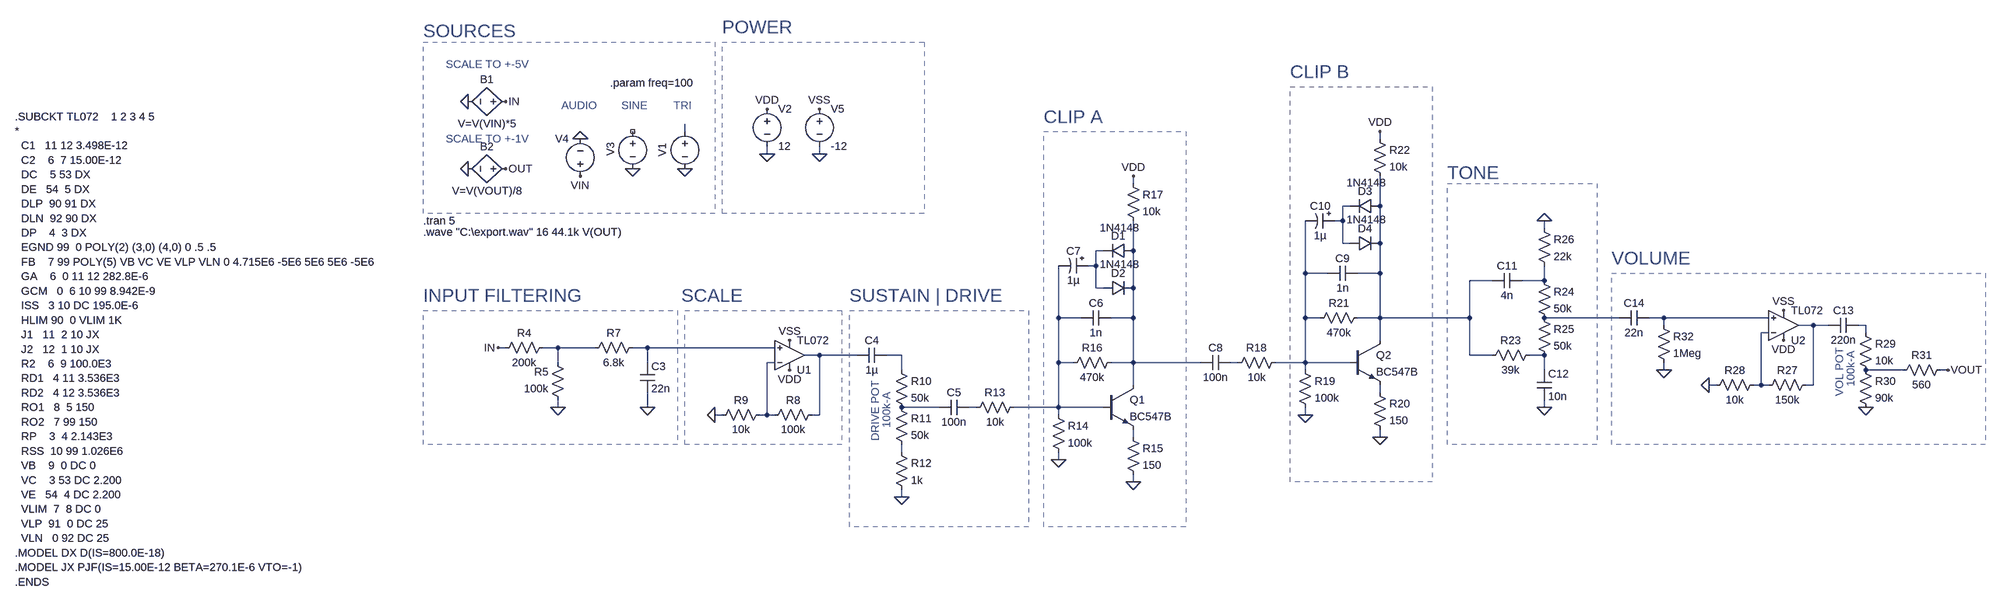
[diagram p0: schematic fuzz.asc]
fuzz.asc, the LTspice schematic file:
Version 4
SHEET 1 3172 1036
WIRE 128 128 128 112
WIRE 1616 144 1616 128
WIRE 304 176 304 160
WIRE 416 176 416 160
WIRE 1088 240 1088 224
WIRE 1552 288 1536 288
WIRE 1616 288 1616 224
WIRE 1536 320 1536 288
WIRE 1536 320 1520 320
WIRE 1968 336 1968 320
WIRE 1536 368 1536 320
WIRE 1552 368 1536 368
WIRE 1616 368 1616 288
WIRE 1024 384 1008 384
WIRE 1088 384 1088 320
WIRE 1008 416 1008 384
WIRE 1008 416 992 416
WIRE 1456 432 1456 320
WIRE 1504 432 1456 432
WIRE 1616 432 1616 368
WIRE 1616 432 1568 432
WIRE 1856 448 1808 448
WIRE 1968 448 1968 416
WIRE 1968 448 1920 448
WIRE 1008 464 1008 416
WIRE 1024 464 1008 464
WIRE 1088 464 1088 384
WIRE 928 528 928 416
WIRE 976 528 928 528
WIRE 1088 528 1088 464
WIRE 1088 528 1040 528
WIRE 1456 528 1456 432
WIRE 1488 528 1456 528
WIRE 1616 528 1616 432
WIRE 1616 528 1568 528
WIRE 1808 528 1808 448
WIRE 1808 528 1616 528
WIRE 2128 528 1968 528
WIRE 2224 528 2192 528
WIRE 2448 528 2224 528
WIRE 2224 544 2224 528
WIRE 2544 544 2512 544
WIRE 2576 544 2544 544
WIRE 2656 544 2640 544
WIRE 2448 560 2432 560
WIRE 2656 560 2656 544
WIRE 1616 576 1616 528
WIRE -256 592 -272 592
WIRE -144 592 -176 592
WIRE -64 592 -144 592
WIRE 48 592 16 592
WIRE 320 592 48 592
WIRE 416 608 384 608
WIRE 496 608 416 608
WIRE 592 608 560 608
WIRE 1808 608 1808 528
WIRE 1856 608 1808 608
WIRE 1968 608 1936 608
WIRE -144 624 -144 592
WIRE 48 624 48 592
WIRE 320 624 304 624
WIRE 928 624 928 528
WIRE 960 624 928 624
WIRE 1088 624 1088 528
WIRE 1088 624 1040 624
WIRE 1232 624 1088 624
WIRE 1312 624 1296 624
WIRE 1456 624 1456 528
WIRE 1456 624 1392 624
WIRE 1552 624 1456 624
WIRE 592 640 592 608
WIRE 1456 640 1456 624
WIRE 1968 640 1968 608
WIRE 2224 640 2224 624
WIRE 2736 640 2656 640
WIRE 2832 640 2816 640
WIRE 1088 672 1088 624
WIRE 2336 672 2320 672
WIRE 2432 672 2432 560
WIRE 2432 672 2416 672
WIRE 2448 672 2432 672
WIRE 2544 672 2544 544
WIRE 2544 672 2528 672
WIRE 1616 688 1616 672
WIRE -144 720 -144 704
WIRE 48 720 48 688
WIRE 672 720 592 720
WIRE 752 720 736 720
WIRE 928 720 928 624
WIRE 928 720 832 720
WIRE 1024 720 928 720
WIRE 1968 720 1968 704
WIRE 208 736 192 736
WIRE 304 736 304 624
WIRE 304 736 288 736
WIRE 320 736 304 736
WIRE 416 736 416 608
WIRE 416 736 400 736
WIRE 928 736 928 720
WIRE 1456 736 1456 720
WIRE 1088 784 1088 768
WIRE 1616 784 1616 768
WIRE 592 816 592 800
WIRE 928 832 928 816
WIRE 1088 880 1088 864
WIRE 592 912 592 896
FLAG -96 224 VIN
FLAG -256 64 IN
FLAG -256 208 OUT
FLAG -272 592 IN
FLAG 352 576 VSS
FLAG 352 640 VDD
FLAG 1088 224 VDD
FLAG 1616 128 VDD
FLAG 2480 512 VSS
FLAG 2480 576 VDD
FLAG 2832 640 VOUT
FLAG 416 176 0
FLAG 304 176 0
FLAG 304 80 VDD
FLAG 416 80 VSS
FLAG 128 208 0
FLAG 16 208 0
FLAG -96 144 0
FLAG -336 208 0
FLAG -336 64 0
FLAG -144 720 0
FLAG 48 720 0
FLAG 192 736 0
FLAG 592 912 0
FLAG 1088 880 0
FLAG 928 832 0
FLAG 1456 736 0
FLAG 1616 784 0
FLAG 1968 720 0
FLAG 1968 320 0
FLAG 2224 640 0
FLAG 2320 672 0
FLAG 2656 720 0
SYMBOL voltage 128 112 R0
WINDOW 0 -32 56 VBottom 2
WINDOW 3 32 56 Invisible 2
WINDOW 123 0 0 Left 0
WINDOW 39 0 0 Left 0
SYMATTR InstName V1
SYMATTR Value PULSE(0 250m 0 {0.5/freq} {0.5/freq} 0 {1/freq})
SYMBOL voltage 16 112 R0
WINDOW 0 -47 39 VRight 2
WINDOW 3 24 96 Invisible 2
WINDOW 123 0 0 Left 0
WINDOW 39 0 0 Left 0
SYMATTR InstName V3
SYMATTR Value SINE(0 1 {freq})
SYMBOL voltage -96 240 R180
WINDOW 0 24 96 Left 2
WINDOW 3 24 16 Invisible 2
SYMATTR InstName V4
SYMATTR Value wavefile="C:\input.wav" chan=0
SYMBOL bv -240 64 R90
WINDOW 0 -32 56 VBottom 2
WINDOW 3 32 56 VTop 2
SYMATTR InstName B1
SYMATTR Value V=V(VIN)*5
SYMBOL bv -240 208 R90
WINDOW 0 -32 56 VBottom 2
WINDOW 3 32 56 VTop 2
SYMATTR InstName B2
SYMATTR Value V=V(VOUT)/8
SYMBOL res -160 576 R90
WINDOW 0 0 56 VBottom 2
WINDOW 3 32 56 VTop 2
SYMATTR InstName R4
SYMATTR Value 200k
SYMBOL res -128 720 R180
WINDOW 0 36 76 Left 2
WINDOW 3 36 40 Left 2
SYMATTR InstName R5
SYMATTR Value 100k
SYMBOL res 32 576 R90
WINDOW 0 0 56 VBottom 2
WINDOW 3 32 56 VTop 2
SYMATTR InstName R7
SYMATTR Value 6.8k
SYMBOL cap 32 624 R0
SYMATTR InstName C3
SYMATTR Value 22n
SYMBOL OpAmps\\opamp2 352 672 M180
SYMATTR InstName U1
SYMATTR Value TL072
SYMBOL res 416 720 R90
WINDOW 0 0 56 VBottom 2
WINDOW 3 32 56 VTop 2
SYMATTR InstName R8
SYMATTR Value 100k
SYMBOL res 304 720 R90
WINDOW 0 0 56 VBottom 2
WINDOW 3 32 56 VTop 2
SYMATTR InstName R9
SYMATTR Value 10k
SYMBOL cap 560 592 R90
WINDOW 0 0 32 VBottom 2
WINDOW 3 32 32 VTop 2
SYMATTR InstName C4
SYMATTR Value 1µ
SYMBOL res 576 624 R0
SYMATTR InstName R10
SYMATTR Value 50k
SYMBOL res 576 704 R0
SYMATTR InstName R11
SYMATTR Value 50k
SYMBOL res 576 800 R0
SYMATTR InstName R12
SYMATTR Value 1k
SYMBOL cap 736 704 R90
WINDOW 0 0 32 VBottom 2
WINDOW 3 32 32 VTop 2
SYMATTR InstName C5
SYMATTR Value 100n
SYMBOL res 848 704 R90
WINDOW 0 0 56 VBottom 2
WINDOW 3 32 56 VTop 2
SYMATTR InstName R13
SYMATTR Value 10k
SYMBOL res 912 720 R0
SYMATTR InstName R14
SYMATTR Value 100k
SYMBOL npn 1024 672 R0
SYMATTR InstName Q1
SYMATTR Value BC547B
SYMBOL res 1072 768 R0
SYMATTR InstName R15
SYMATTR Value 150
SYMBOL res 1056 608 R90
WINDOW 0 0 56 VBottom 2
WINDOW 3 32 56 VTop 2
SYMATTR InstName R16
SYMATTR Value 470k
SYMBOL cap 1040 512 R90
WINDOW 0 0 32 VBottom 2
WINDOW 3 32 32 VTop 2
SYMATTR InstName C6
SYMATTR Value 1n
SYMBOL polcap 992 400 R90
WINDOW 0 0 32 VBottom 2
WINDOW 3 32 32 VTop 2
SYMATTR InstName C7
SYMATTR Value 1µ
SYMBOL diode 1088 368 R90
WINDOW 0 0 32 VBottom 2
WINDOW 3 -18 29 VBottom 2
SYMATTR InstName D1
SYMATTR Value 1N4148
SYMBOL diode 1024 480 R270
WINDOW 0 32 32 VTop 2
WINDOW 3 51 35 VTop 2
SYMATTR InstName D2
SYMATTR Value 1N4148
SYMBOL res 1072 224 R0
SYMATTR InstName R17
SYMATTR Value 10k
SYMBOL cap 1296 608 R90
WINDOW 0 0 32 VBottom 2
WINDOW 3 32 32 VTop 2
SYMATTR InstName C8
SYMATTR Value 100n
SYMBOL res 1408 608 R90
WINDOW 0 0 56 VBottom 2
WINDOW 3 32 56 VTop 2
SYMATTR InstName R18
SYMATTR Value 10k
SYMBOL res 1440 624 R0
SYMATTR InstName R19
SYMATTR Value 100k
SYMBOL npn 1552 576 R0
SYMATTR InstName Q2
SYMATTR Value BC547B
SYMBOL res 1600 672 R0
SYMATTR InstName R20
SYMATTR Value 150
SYMBOL res 1584 512 R90
WINDOW 0 0 56 VBottom 2
WINDOW 3 32 56 VTop 2
SYMATTR InstName R21
SYMATTR Value 470k
SYMBOL cap 1568 416 R90
WINDOW 0 0 32 VBottom 2
WINDOW 3 32 32 VTop 2
SYMATTR InstName C9
SYMATTR Value 1n
SYMBOL polcap 1520 304 R90
WINDOW 0 0 32 VBottom 2
WINDOW 3 32 32 VTop 2
SYMATTR InstName C10
SYMATTR Value 1µ
SYMBOL diode 1616 272 R90
WINDOW 0 0 32 VBottom 2
WINDOW 3 -18 29 VBottom 2
SYMATTR InstName D3
SYMATTR Value 1N4148
SYMBOL diode 1552 384 R270
WINDOW 0 32 32 VTop 2
WINDOW 3 51 35 VTop 2
SYMATTR InstName D4
SYMATTR Value 1N4148
SYMBOL res 1600 128 R0
SYMATTR InstName R22
SYMATTR Value 10k
SYMBOL res 1952 592 R90
WINDOW 0 0 56 VBottom 2
WINDOW 3 32 56 VTop 2
SYMATTR InstName R23
SYMATTR Value 39k
SYMBOL cap 1920 432 R90
WINDOW 0 0 32 VBottom 2
WINDOW 3 32 32 VTop 2
SYMATTR InstName C11
SYMATTR Value 4n
SYMBOL res 1952 432 R0
SYMATTR InstName R24
SYMATTR Value 50k
SYMBOL res 1952 512 R0
SYMATTR InstName R25
SYMATTR Value 50k
SYMBOL res 1952 320 R0
SYMATTR InstName R26
SYMATTR Value 22k
SYMBOL cap 1952 640 R0
SYMATTR InstName C12
SYMATTR Value 10n
SYMBOL OpAmps\\opamp2 2480 608 M180
SYMATTR InstName U2
SYMATTR Value TL072
SYMBOL res 2544 656 R90
WINDOW 0 0 56 VBottom 2
WINDOW 3 32 56 VTop 2
SYMATTR InstName R27
SYMATTR Value 150k
SYMBOL res 2432 656 R90
WINDOW 0 0 56 VBottom 2
WINDOW 3 32 56 VTop 2
SYMATTR InstName R28
SYMATTR Value 10k
SYMBOL res 2640 544 R0
SYMATTR InstName R29
SYMATTR Value 10k
SYMBOL res 2640 624 R0
SYMATTR InstName R30
SYMATTR Value 90k
SYMBOL res 2832 624 R90
WINDOW 0 0 56 VBottom 2
WINDOW 3 32 56 VTop 2
SYMATTR InstName R31
SYMATTR Value 560
SYMBOL cap 2640 528 R90
WINDOW 0 0 32 VBottom 2
WINDOW 3 32 32 VTop 2
SYMATTR InstName C13
SYMATTR Value 220n
SYMBOL res 2208 528 R0
SYMATTR InstName R32
SYMATTR Value 1Meg
SYMBOL cap 2192 512 R90
WINDOW 0 0 32 VBottom 2
WINDOW 3 32 32 VTop 2
SYMATTR InstName C14
SYMATTR Value 22n
SYMBOL voltage 304 64 R0
WINDOW 123 0 0 Left 0
WINDOW 39 0 0 Left 0
SYMATTR InstName V2
SYMATTR Value 12
SYMBOL voltage 416 64 R0
WINDOW 123 0 0 Left 0
WINDOW 39 0 0 Left 0
SYMATTR InstName V5
SYMATTR Value -12
TEXT -32 24 Left 2 !.param freq=100
TEXT -8 72 Left 2 ;SINE
TEXT 104 72 Left 2 ;TRI
TEXT -136 72 Left 2 ;AUDIO
TEXT -432 -88 Left 4 ;SOURCES
TEXT 208 -96 Left 4 ;POWER
TEXT -384 -16 Left 2 ;SCALE TO +-5V
TEXT -384 144 Left 2 ;SCALE TO +-1V
TEXT -432 320 Left 2 !.tran 5
TEXT -432 344 Left 2 !.wave "C:\\export.wav" 16 44.1k V(OUT)
TEXT -432 480 Left 4 ;INPUT FILTERING
TEXT 120 480 Left 4 ;SCALE
TEXT 536 664 VRight 2 ;DRIVE POT
TEXT 560 688 VRight 2 ;100k-A
TEXT 480 480 Left 4 ;SUSTAIN | DRIVE
TEXT 896 96 Left 4 ;CLIP A
TEXT -1488 96 Left 2 !.SUBCKT TL072    1 2 3 4 5\n*\n  C1   11 12 3.498E-12\n  C2    6  7 15.00E-12\n  DC    5 53 DX\n  DE   54  5 DX\n  DLP  90 91 DX\n  DLN  92 90 DX\n  DP    4  3 DX\n  EGND 99  0 POLY(2) (3,0) (4,0) 0 .5 .5\n  FB    7 99 POLY(5) VB VC VE VLP VLN 0 4.715E6 -5E6 5E6 5E6 -5E6\n  GA    6  0 11 12 282.8E-6\n  GCM   0  6 10 99 8.942E-9\n  ISS   3 10 DC 195.0E-6\n  HLIM 90  0 VLIM 1K\n  J1   11  2 10 JX\n  J2   12  1 10 JX\n  R2    6  9 100.0E3\n  RD1   4 11 3.536E3\n  RD2   4 12 3.536E3\n  RO1   8  5 150\n  RO2   7 99 150\n  RP    3  4 2.143E3\n  RSS  10 99 1.026E6\n  VB    9  0 DC 0\n  VC    3 53 DC 2.200\n  VE   54  4 DC 2.200\n  VLIM  7  8 DC 0\n  VLP  91  0 DC 25\n  VLN   0 92 DC 25\n.MODEL DX D(IS=800.0E-18)\n.MODEL JX PJF(IS=15.00E-12 BETA=270.1E-6 VTO=-1)\n.ENDS
TEXT 1424 0 Left 4 ;CLIP B
TEXT 1760 216 Left 4 ;TONE
TEXT 2600 592 VRight 2 ;VOL POT
TEXT 2624 600 VRight 2 ;100k-A
TEXT 2112 400 Left 4 ;VOLUME
RECTANGLE Normal 640 304 208 -64 1
RECTANGLE Normal 192 304 -432 -64 1
RECTANGLE Normal 112 800 -432 512 1
RECTANGLE Normal 464 800 128 512 1
RECTANGLE Normal 864 976 480 512 1
RECTANGLE Normal 1200 976 896 128 1
RECTANGLE Normal 1728 880 1424 32 1
RECTANGLE Normal 2080 800 1760 240 1
RECTANGLE Normal 2912 800 2112 432 1

The netlist it stands for:
* fuzz.asc
V1 N001 0 PULSE(0 250m 0 {0.5/freq} {0.5/freq} 0 {1/freq})
V3 NC_01 0 SINE(0 1 {freq})
V4 VIN 0 wavefile="C:\input.wav" chan=0
B1 IN 0 V=V(VIN)*5
B2 OUT 0 V=V(VOUT)/8
R4 N014 IN 200k
R5 0 N014 100k
R7 N015 N014 6.8k
C3 N015 0 22n
XU1 N015 N019 VDD VSS N016 TL072  ; pins In+ In- V+ V- OUT
R8 N016 N019 100k
R9 N019 0 10k
C4 N017 N016 1µ
R10 N017 N023 50k
R11 N023 N026 50k
R12 N026 0 1k
C5 N024 N023 100n
R13 N008 N024 10k
R14 N008 0 100k
Q1 N005 N008 N025 0 BC547B
R15 N025 0 150
R16 N005 N008 470k
C6 N005 N008 1n
C7 N004 N008 1µ
D1 N005 N004 1N4148
D2 N004 N005 1N4148
R17 VDD N005 10k
C8 N020 N005 100n
R18 N006 N020 10k
R19 N006 0 100k
Q2 N003 N006 N022 0 BC547B
R20 N022 0 150
R21 N003 N006 470k
C9 N003 N006 1n
C10 N002 N006 1µ
D3 N003 N002 1N4148
D4 N002 N003 1N4148
R22 VDD N003 10k
R23 N018 N003 39k
C11 N007 N003 4n
R24 N007 N009 50k
R25 N009 N018 50k
R26 0 N007 22k
C12 N018 0 10n
XU2 N010 N013 VDD VSS N011 TL072  ; pins In+ In- V+ V- OUT
R27 N011 N013 150k
R28 N013 0 10k
R29 N012 N021 10k
R30 N021 0 90k
R31 VOUT N021 560
C13 N012 N011 220n
R32 N010 0 1Meg
C14 N010 N009 22n
V2 VDD 0 12
V5 VSS 0 -12
.model D D
.lib standard.dio
.model NPN NPN
.model PNP PNP
.lib standard.bjt
.param freq=100
* SINE
* TRI
* AUDIO
* SOURCES
* POWER
* SCALE TO +-5V
* SCALE TO +-1V
.tran 5
.wave "C:\export.wav" 16 44.1k V(OUT)
* INPUT FILTERING
* SCALE
* DRIVE POT
* 100k-A
* SUSTAIN | DRIVE
* CLIP A
.SUBCKT TL072    1 2 3 4 5
*
  C1   11 12 3.498E-12
  C2    6  7 15.00E-12
  DC    5 53 DX
  DE   54  5 DX
  DLP  90 91 DX
  DLN  92 90 DX
  DP    4  3 DX
  EGND 99  0 POLY(2) (3,0) (4,0) 0 .5 .5
  FB    7 99 POLY(5) VB VC VE VLP VLN 0 4.715E6 -5E6 5E6 5E6 -5E6
  GA    6  0 11 12 282.8E-6
  GCM   0  6 10 99 8.942E-9
  ISS   3 10 DC 195.0E-6
  HLIM 90  0 VLIM 1K
  J1   11  2 10 JX
  J2   12  1 10 JX
  R2    6  9 100.0E3
  RD1   4 11 3.536E3
  RD2   4 12 3.536E3
  RO1   8  5 150
  RO2   7 99 150
  RP    3  4 2.143E3
  RSS  10 99 1.026E6
  VB    9  0 DC 0
  VC    3 53 DC 2.200
  VE   54  4 DC 2.200
  VLIM  7  8 DC 0
  VLP  91  0 DC 25
  VLN   0 92 DC 25
.MODEL DX D(IS=800.0E-18)
.MODEL JX PJF(IS=15.00E-12 BETA=270.1E-6 VTO=-1)
.ENDS
* CLIP B
* TONE
* VOL POT
* 100k-A
* VOLUME
.backanno
.end